# Altium schematic sheet Sheet1.SchDoc
size B
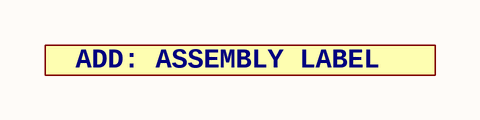
[diagram p0: Sheet1.SchDoc]

## Parts
LABEL1  ADDON, ASSEMBLY LABEL  [HARDWARE, ASSEMBLY LABEL]  (value not drawn)  (no BOM)

## Notes on the sheet
- DATE
- DWN BY
- TITLE
- NO.
- CHANGES
- BY / DATE
- CHKD
- APPD
- DWYER INSTRUMENTS, INC.
- MICHIGAN CITY, INDIANA 46360 U.S.A.
- used except as previously authorized in writing by such corporation and must not be submitted to
- outside parties for examination without the written consent of said corporation.
- NOTICE: this drawing and principles and elements of design embodied therein are the exclusive
- propery of DWYER INSTRUMENTS, INC. and are not to be communicated, disclosed, reproduced or
- FR. NO.
- SIZE B
- ALTIUM DESIGNER
- SHEET
- OF
- (in symbol 2458359.37568) ADD: ASSEMBLY LABEL

## Library data of the parts
LABEL1 = 2458359.37568: Label, Assembly, 0.25" x 0.75"; MFR: A/R; FR Number: None; AVL Description: ** Not in AVL yet **; Key Field: 2458359.37568; MFR No: A/R; RoHS: UNKNOWN